# EAGLE design devboard-8.0 (EAGLE 6.3)
Assembly variants: 3cpu, proto
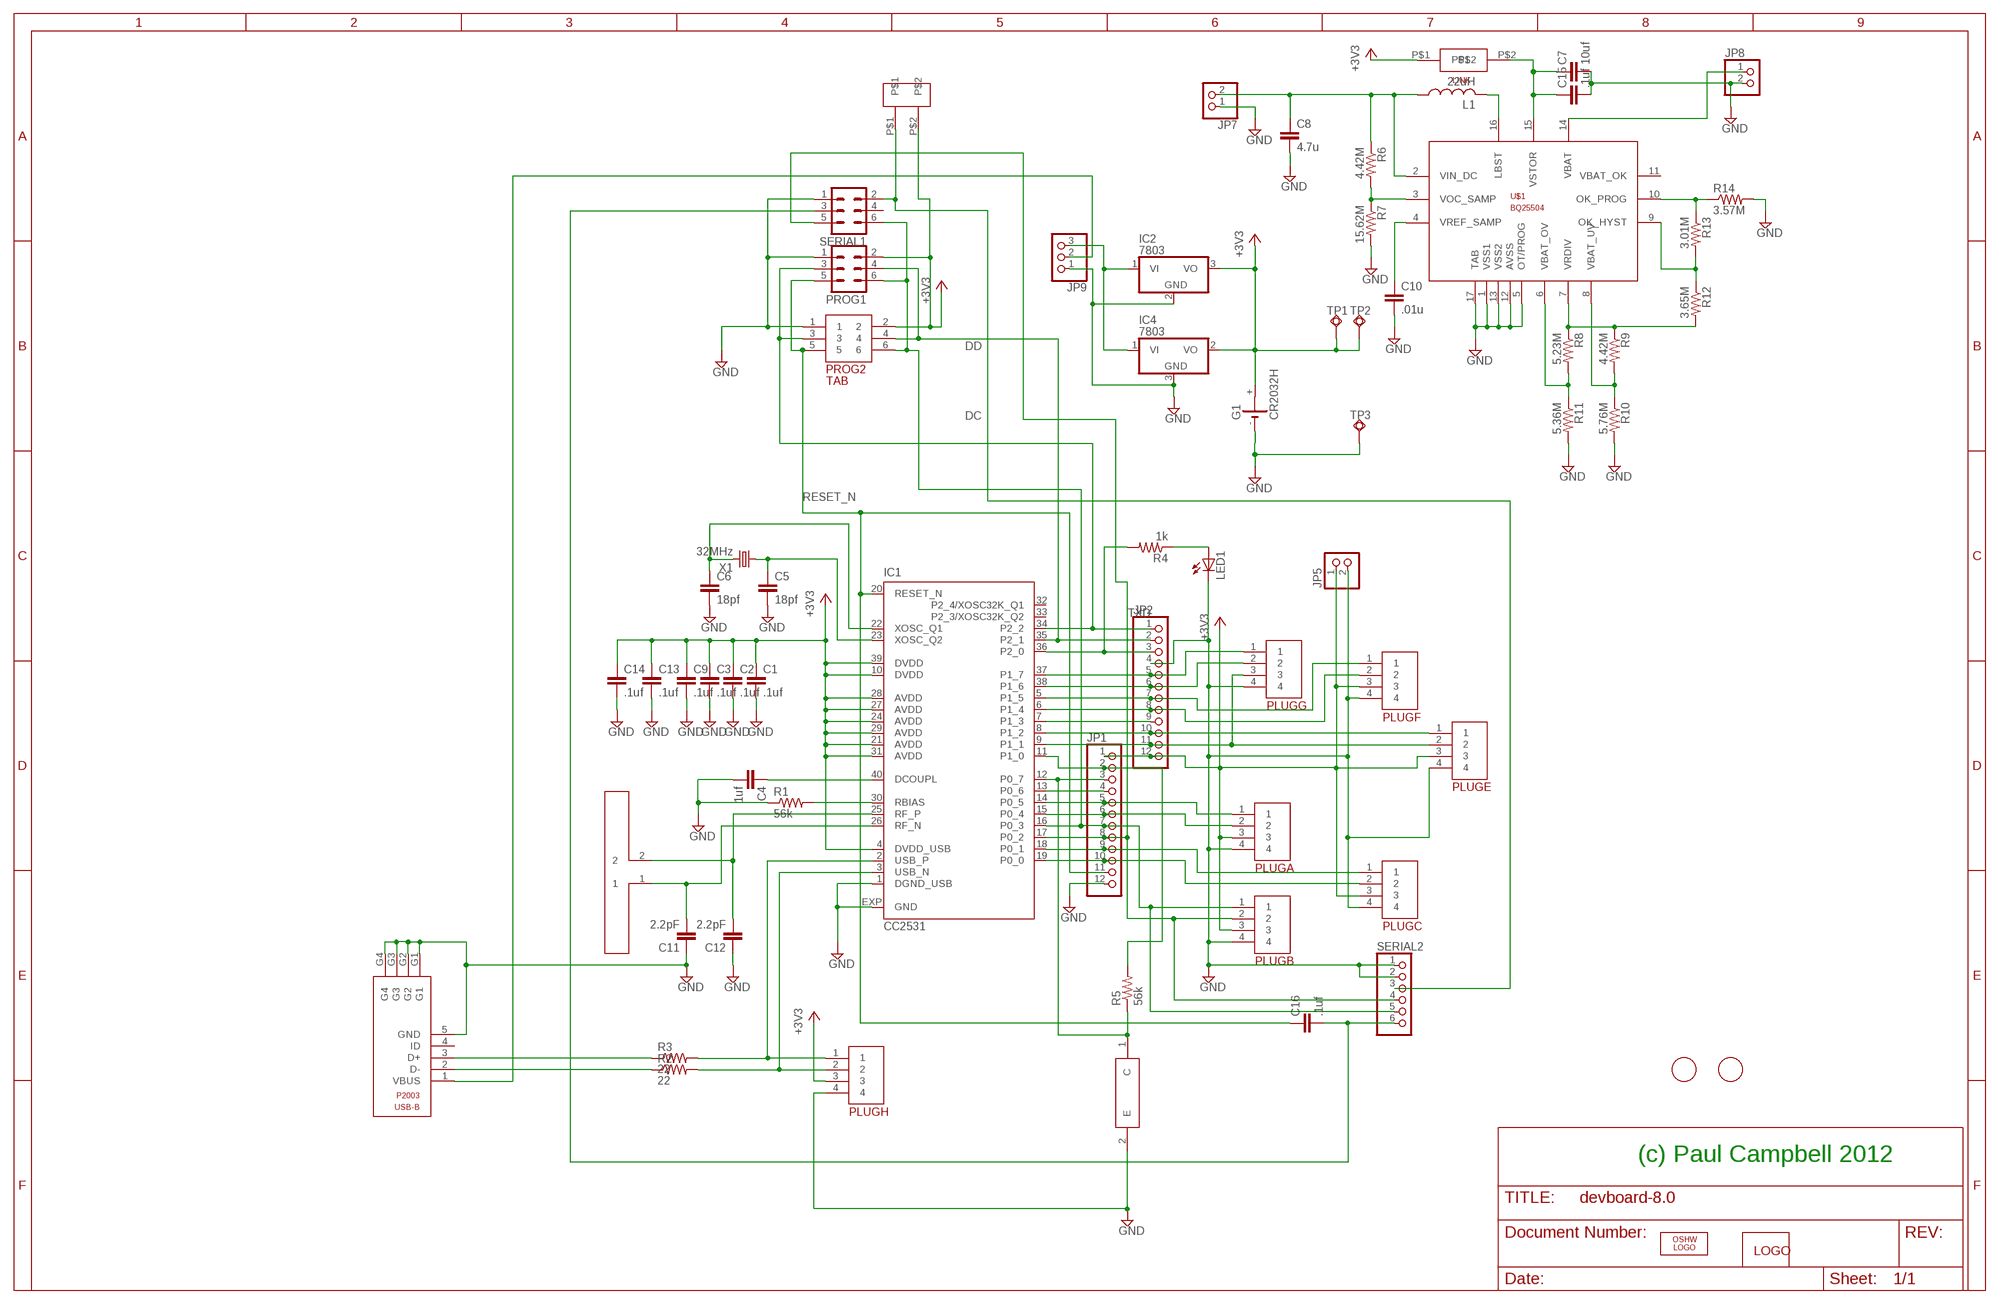
[diagram p0: schematic, sheet 1]

## Parts
C1  .1uf  C-EUC0603K  [C0603K]
C2  .1uf  C-EUC0603K  [C0603K]
C3  .1uf  C-EUC0603K  [C0603K]
C4  1uf  C-EUC0603K  [C0603K]
C5  18pf  C-EUC0603  [C0603]
C6  18pf  C-EUC0603  [C0603]
C7  10uf  C-EUC1206  [C1206]
C8  4.7u  C-EUC0603  [C0603]
C9  .1uf  C-EUC0603K  [C0603K]
C10  .01u  C-EUC0603  [C0603]
C11  2.2pF  C-EUC0402  [C0402]
C12  2.2pF  C-EUC0402  [C0402]
C13  .1uf  C-EUC0603K  [C0603K]
C14  .1uf  C-EUC0603K  [C0603K]
C15  .1uf  C-EUC0603K  [C0603K]
C16  .1uf  C-EUC0603K  [C0603K]
G1  CR2032H  [CR2032H]
IC1  CC2531  [RHA_S-PVQFN-N40]
IC2  7803  7805TV  [TO220V]
IC4  7803  7805DT  [TO252]
JP1  PINHD-1X12-CB  [1X12-CB]
JP2  PINHD-1X12-CB  [1X12-CB]
JP5  PINHD-1X2  [1X02]
JP7  PINHD-1X2  [1X02]
JP8  PINHD-1X2  [1X02]
JP9  PINHD-1X3  [1X03]
L1  22uH  L-USL2012C  [L2012C]
LED1  LEDCHIP-LED0603  [CHIP-LED0603]
LOGO1  OSHW_LOGO_FILLX0100-NT  [OSHW_FILLX100_NOTEXT]
P2003  FCI1018193-USBB  [FCI1018193-USBB]  (not fitted in variant 3cpu)  (not fitted in variant proto)
PLUGA  PIN4  [PIN4-2MM]
PLUGB  PIN4  [PIN4-2MM]
PLUGC  PIN4  [PIN4-2MM]
PLUGE  PIN4  [PIN4-2MM]
PLUGF  PIN4  [PIN4-2MM]
PLUGG  PIN4  [PIN4-2MM]
PLUGH  PIN4  [PIN4-2MM]
PROG1  MA03-2  [MA03-2]
PROG2  TAB  [TAG]
Q1  KDT  [KDT]
R1  56k  R-US_R0603  [R0603]
R2  22  R-US_R0603  [R0603]
R3  22  R-US_R0603  [R0603]
R4  1k  R-US_R0603  [R0603]
R5  56k  R-US_R0603  [R0603]
R6  4.42M  R-US_R0603  [R0603]
R7  15.62M  R-US_R0603  [R0603]
R8  5.23M  R-US_R0603  [R0603]
R9  4.42M  R-US_R0603  [R0603]
R10  5.76M  R-US_R0603  [R0603]
R11  5.36M  R-US_R0603  [R0603]
R12  3.65M  R-US_R0603  [R0603]
R13  3.01M  R-US_R0603  [R0603]
R14  3.57M  R-US_R0603  [R0603]
SERIAL1  MA03-2  [MA03-2]
SERIAL2  PINHD-1X6  [1X06]
SERIAL-POWER  2-PAD  [2-PAD]
TP1  TPSQPAD1-13  [P1-13]
TP2  TPSQPAD1-13  [P1-13]
TP3  TPSQPAD1-13  [P1-13]
U$1  BQ25504  [QF16]
U$2  FIDUCIAL  [FIDUCIAL_1MM]
U$3  DIPOLEDIPOLE1  [DIPOLE]
U$4  2-PAD-LINK  [2-PAD-LINK]
U$5  MOONBASE-LOGO  [MOONBASE-LOGO]
U$18  FIDUCIAL  [FIDUCIAL_1MM]
X1  32MHz  CRYSTALSM49  [SM49]

## Nets
+3V3: C1.1 C2.1 C3.1 C9.1 C13.1 C14.1 G1.+ IC1.4(DVDD_USB) IC1.10(DVDD) IC1.21(AVDD) IC1.24(AVDD) IC1.27(AVDD) IC1.28(AVDD) IC1.29(AVDD) IC1.31(AVDD) IC1.39(DVDD) IC2.3(VO) IC4.2(VO) JP1.1 JP2.12 JP5.1 PLUGA.3 PLUGB.3 PLUGC.3 PLUGE.3 PLUGF.3 PLUGH.3 PROG1.2 PROG2.2 SERIAL-POWER.P$2 TP1.TP TP2.TP U$4.P$1
DC: IC1.34(P2_2) JP2.1 PROG1.3 PROG2.3
DD: IC1.35(P2_1) JP2.2 PROG1.4 PROG2.4
GND: C1.2 C2.2 C3.2 C4.2 C5.2 C6.2 C7.2 C8.2 C9.2 C10.2 C11.1 C12.1 C13.2 C14.2 C15.2 G1.- IC1.1(DGND_USB) IC1.EXP(GND) IC2.2(GND) IC4.3(GND) JP1.12 JP2.4 JP5.2 JP7.1 JP8.2 JP9.1 LED1.C P2003.5(GND) P2003.G1 P2003.G2 P2003.G3 P2003.G4 PLUGA.4 PLUGB.4 PLUGC.4 PLUGE.4 PLUGF.4 PLUGG.4 PLUGH.4 PROG1.1 PROG2.1 Q1.2(E) R1.1 R7.2 R10.2 R11.2 R14.2 SERIAL1.1 SERIAL2.1 SERIAL2.2 TP3.TP U$1.1(VSS1) U$1.5(OT/PROG) U$1.12(AVSS) U$1.13(VSS2) U$1.17(TAB)
N$1: LED1.A R4.1
N$2: JP9.2 P2003.1(VBUS)
N$3: IC1.2(USB_P) PLUGH.1 R3.2
N$4: P2003.2(D-) R2.1
N$5: IC1.3(USB_N) PLUGH.2 R2.2
N$6: SERIAL1.2 SERIAL2.3 SERIAL-POWER.P$1
N$7: P2003.3(D+) R3.1
N$8: IC1.11(P1_0) JP1.2 R5.2
N$9: IC2.1(VI) IC4.1(VI) JP9.3
N$10: C4.1 IC1.40(DCOUPL)
N$11: IC1.13(P0_6) JP1.4
N$12: IC1.14(P0_5) JP1.5 PLUGA.1
N$13: C7.1 C15.1 U$1.15(VSTOR) U$4.P$2
N$14: IC1.18(P0_1) JP1.9 PLUGC.1
N$15: IC1.19(P0_0) JP1.10 PLUGC.2
N$16: IC1.9(P1_1) JP2.11 PLUGE.2 PLUGG.3
N$17: IC1.8(P1_2) JP2.10 PLUGE.1
N$18: C6.1 IC1.22(XOSC_Q1) X1.2
N$19: C5.1 IC1.23(XOSC_Q2) X1.1
N$20: IC1.12(P0_7) JP1.3 Q1.1(C) R5.1
N$21: IC1.7(P1_3) JP2.9
N$22: IC1.30(RBIAS) R1.2
N$23: IC1.6(P1_4) JP2.8 PLUGF.2
N$24: C12.2 IC1.25(RF_P) U$3.2
N$25: C11.2 IC1.26(RF_N) U$3.1
N$26: IC1.5(P1_5) JP2.7 PLUGF.1
N$27: IC1.38(P1_6) JP2.6 PLUGG.2
N$28: IC1.37(P1_7) JP2.5 PLUGG.1
N$29: IC1.36(P2_0) JP2.3 R4.2
N$30: IC1.15(P0_4) JP1.6 PLUGA.2
N$31: C16.2 SERIAL1.3 SERIAL2.6
N$33: L1.2 U$1.16(LBST)
N$34: C8.1 JP7.2 L1.1 R6.1 U$1.2(VIN_DC)
N$35: JP8.1 U$1.14(VBAT)
N$36: R6.2 R7.1 U$1.3(VOC_SAMP)
N$37: C10.1 U$1.4(VREF_SAMP)
N$38: R8.2 R11.1 U$1.6(VBAT_OV)
N$39: R9.2 R10.1 U$1.8(VBAT_UV)
N$40: R13.1 R14.1 U$1.10(OK_PROG)
N$41: R8.1 R9.1 R12.2 U$1.7(VRDIV)
N$42: R12.1 R13.2 U$1.9(OK_HYST)
RESET_N: C16.1 IC1.20(RESET_N) JP1.11 PROG1.5 PROG2.5
RXD: IC1.17(P0_2) JP1.8 PLUGB.2 SERIAL1.5 SERIAL2.4
TXD: IC1.16(P0_3) JP1.7 PLUGB.1 PROG1.6 PROG2.6 SERIAL1.6 SERIAL2.5
Unconnected: G1.+@1(+) IC1.32(P2_4/XOSC32K_Q1) IC1.33(P2_3/XOSC32K_Q2) P2003.4(ID) SERIAL1.4 U$1.11(VBAT_OK)

## Notes on the sheet
- (c) Paul Campbell 2012

## Library data of the parts
C1-C16 = rcl:C-EU: CAPACITOR, European symbol
G1 = battery:CR2032H: LI BATTERY Varta
IC1 = texas:CC2531: A USB Enabled System-On-Chip Solution for 2.4-GHz IEEE 802.15.4 and ZigBee Source: http://focus.ti.com/lit/ds/symlink/cc2531.pdf; MPN: CC2531F256RHAT; OC_FARNELL: 1776351; OC_NEWARK: 34R2713
IC2 IC4 = linear:78*: Positive VOLTAGE REGULATOR Source: http://cache.national.com/ds/LM/LM78L05.pdf http://www.fairchildsemi.com/ds/LM/LM7805.pdf
JP1 JP2 = adafruit:PINHD-1X12: PIN HEADER
JP5 JP7 JP8 = pinhead:PINHD-1X2: PIN HEADER
JP9 = adafruit:PINHD-1X3: PIN HEADER
L1 = rcl:L-US: INDUCTOR, American symbol
LED1 = adafruit:LED: LED OSRAM: - CHIPLED LG R971, LG N971, LY N971, LG Q971, LY Q971, LO R971, LY R971 LH N974, LH R974 LS Q976, LO Q976, LY Q976 LO Q996 - Hyper CHIPLED LW Q18S LB Q993, LB Q99A, LB R99A - SideLED LS A670, LO A670, LY A670, LG A670, LP A670 LB A673, LV A673, LT A673, LW A673 LH A674 LY A675 LS A676, LA A676, LO A676, LY A676, LW A676 LS A679, LY A679, LG A679 - Hyper Micro SIDELED® LS Y876, LA Y876, LO Y876, LY Y876 LT Y87S - SmartLED LW L88C, LW L88S LB L89C, LB L89S, LG L890 LS L89K, LO L89K, LY L89K LS L896, LA L896, LO L896, LY L896 - TOPLED LS T670, LO T670, LY T670, LG T670, LP T670 LSG T670, LSP T670, LSY T670, LOP T670, LYG T670 LG T671, LOG T671, LSG T671 LB T673, LV T673, LT T673, LW T673 LH T674 LS T676, LA T676, LO T676, LY T676, LB T676, LH T676, LSB T676, LW T676 LB T67C, LV T67C, LT T67C, LS T67K, LO T67K, LY T67K, LW E67C LS E67B, LA E67B, LO E67B, LY E67B, LB E67C, LV E67C, LT E67C LW T67C LS T679, LY T679, LG T679 LS T770, LO T770, LY T770, LG T770, LP T770 LB T773, LV T773, LT T773, LW T773 LH T774 LS E675, LA E675, LY E675, LS T675 LS T776, LA T776, LO T776, LY T776, LB T776 LHGB T686 LT T68C, LB T68C - Hyper Mini TOPLED® LB M676 - Mini TOPLED Santana® LG M470 LS M47K, LO M47K, LY M47K Source: http://www.osram.convergy.de/
LOGO1 = ohw-logo:OSHW_LOGO_FILL
P2003 = freescale-imx6:FCI1018193-USBB
PLUGA PLUGB PLUGC PLUGE PLUGF PLUGG PLUGH = playa:PIN4
PROG1 SERIAL1 = con-lstb:MA03-2: PIN HEADER
PROG2 = br:TAB
Q1 = playa:KDT
R1-R14 = rcl:R-US_: RESISTOR, American symbol
SERIAL2 = adafruit:PINHD-1X6: PIN HEADER
SERIAL-POWER = playa:2-PAD
TP1-TP3 = testpad:TPSQ: Test pad
U$1 = playa:BQ25504
U$2 U$18 = adafruit:FIDUCIAL: For use by pick and place machines to calibrate the vision/machine, 1mm By microbuilder.eu
U$3 = playa:DIPOLE
U$4 = playa:2-PAD-LINK
U$5 = ll:MOONBASE-LOGO
X1 = crystal:CRYSTAL: CRYSTAL; OC_FARNELL: unknown; OC_NEWARK: unknown

## Board
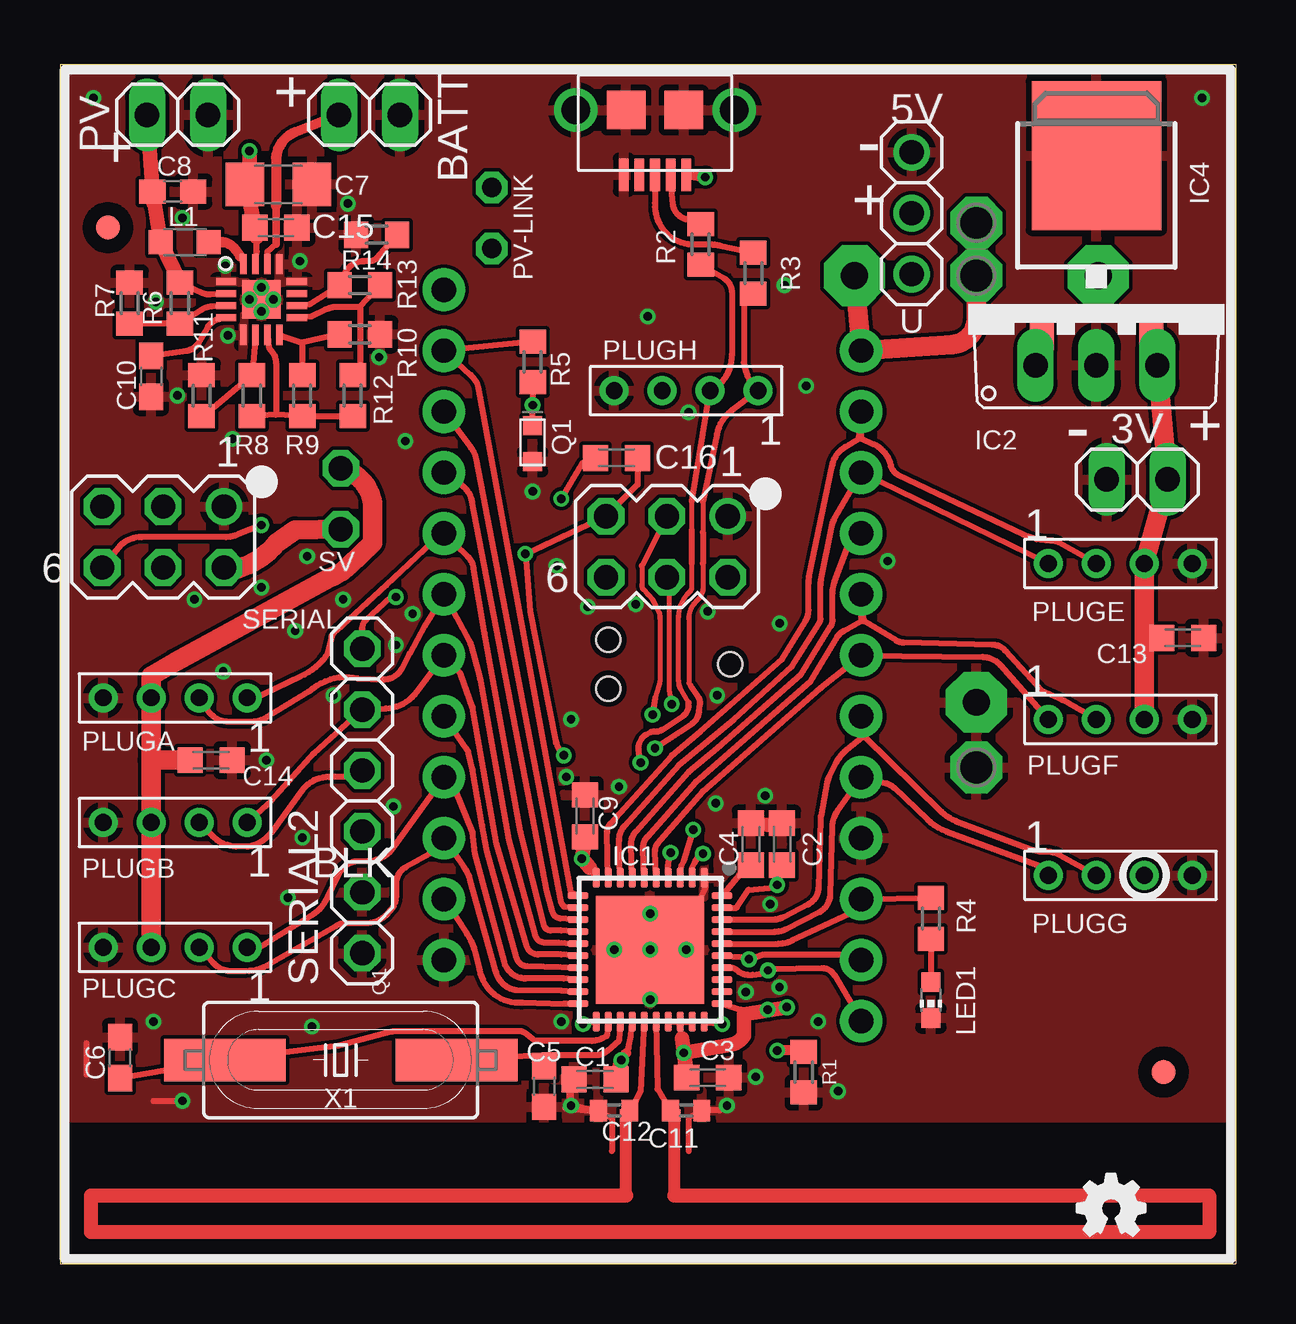
[diagram p1: board, top side]
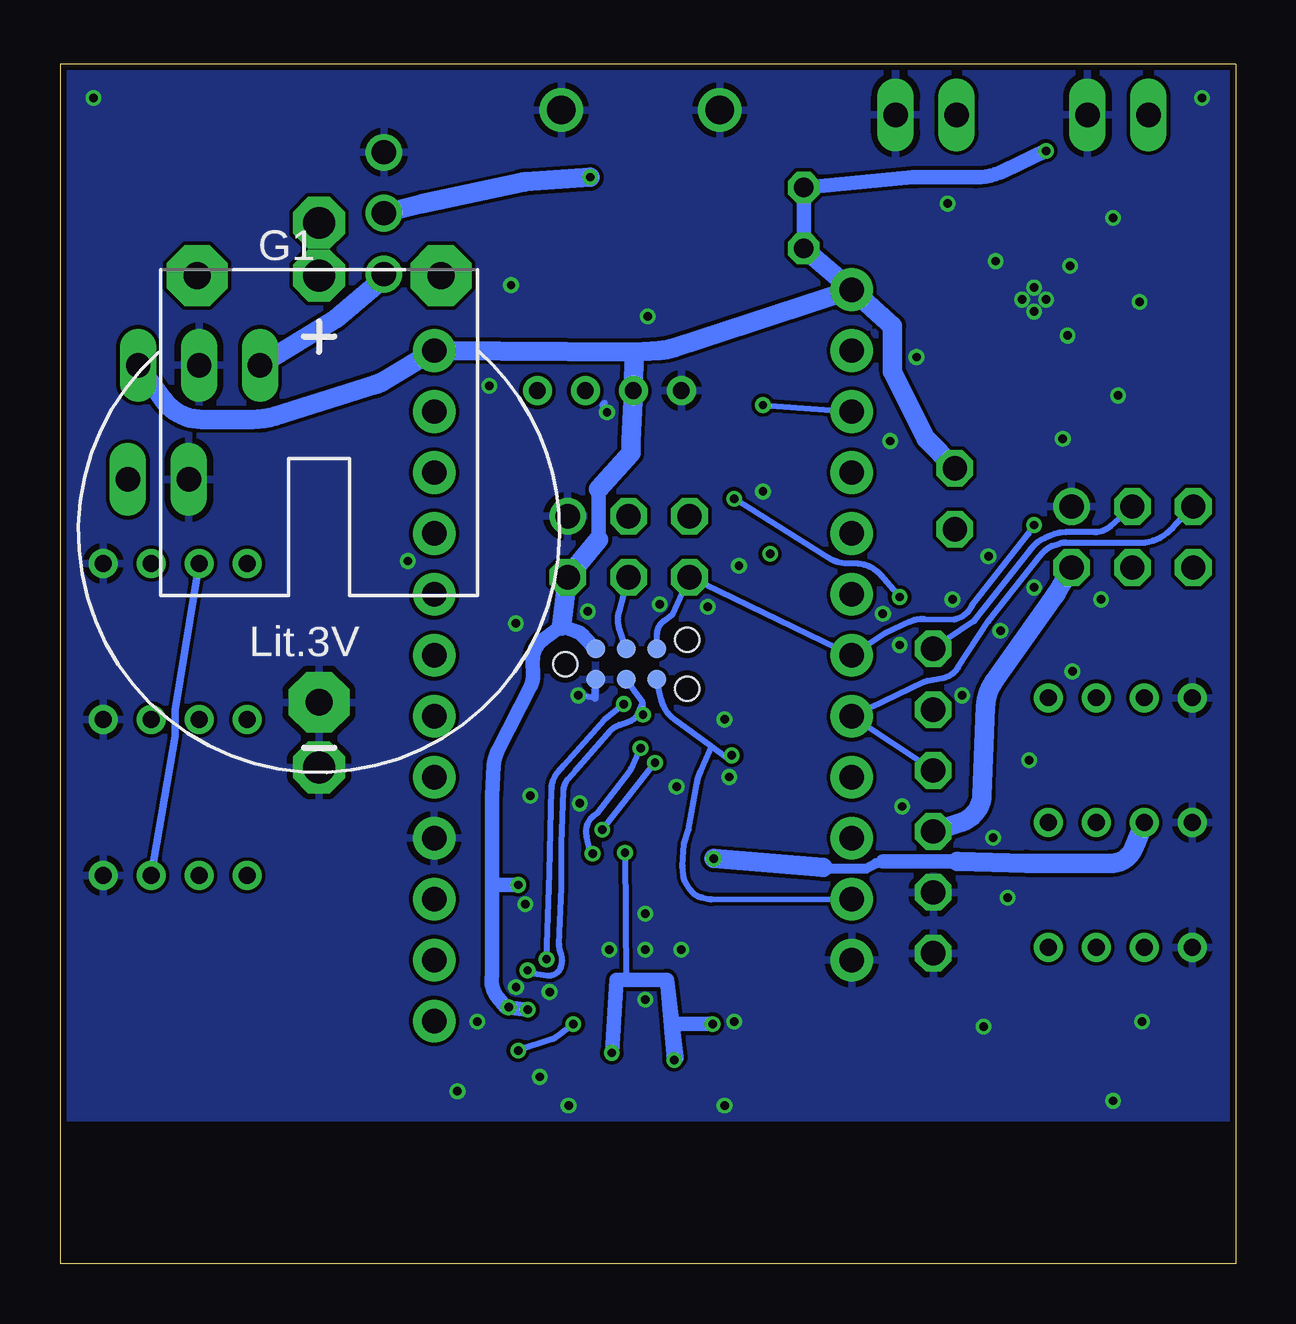
[diagram p2: board, bottom side, seen from below]

Size 49 x 50 mm. Coordinates in mm from the lower left corner, seen from the top.
Outline: 0,0 49,0 49,50 0,50 0,0
Copper layers (1*16): Top 0.035mm / dielectric 1.5mm / Bottom 0.035mm
Design rules "Fusion_eagle_rule_v1.1": minimum track width 6mil, minimum drill 12mil, track to track 6mil, track to pad 6mil, pad to pad 6mil, via to via 6mil, smd to smd 0mil, copper to edge 10mil, drill to drill 10mil, minimum pad ring 10mil, minimum via ring 6mil, stop-mask expansion 2mil, vias tented up to drill 100mil, thermal gap 10mil

### Footprints (pad centres in the part's own frame; a part is rotated, then mirrored left to right if it is on the bottom)
C0603K = smd 1.05 x 1.08: 1 -0.875,0; 2 0.875,0
C0603 = smd 1.1 x 1: 1 -0.85,0; 2 0.85,0
C1206 = smd 1.6 x 1.8: 1 -1.4,0; 2 1.4,0
C0402 = smd 0.7 x 0.9: 1 -0.65,0; 2 0.65,0
CR2032H = drill 1.118 pad 2.54 octagon: + 5.08,10.795; +@1 -5.08,10.795; - 0,-6.985
RHA_S-PVQFN-N40 = smd 0.85 x 0.3: 1 -3,2.25; 2 -3,1.75; 3 -3,1.25; 4 -3,0.75; 5 -3,0.25; 6 -3,-0.25; 7 -3,-0.75; 8 -3,-1.25; 9 -3,-1.75; 10 -3,-2.25; 21 3,-2.25; 22 3,-1.75; 23 3,-1.25; 24 3,-0.75; 25 3,-0.25; 26 3,0.25; 27 3,0.75; 28 3,1.25; 29 3,1.75; 30 3,2.25 | smd 0.3 x 0.85: 11 -2.25,-3; 12 -1.75,-3; 13 -1.25,-3; 14 -0.75,-3; 15 -0.25,-3; 16 0.25,-3; 17 0.75,-3; 18 1.25,-3; 19 1.75,-3; 20 2.25,-3; 31 2.25,3; 32 1.75,3; 33 1.25,3; 34 0.75,3; 35 0.25,3; 36 -0.25,3; 37 -0.75,3; 38 -1.25,3; 39 -1.75,3; 40 -2.25,3 | smd 4.5 x 4.5: EXP 0,0
TO220V = drill 1.016 long: 1 -2.54,-2.54; 2 0,-2.54; 3 2.54,-2.54
TO252 = smd 1 x 1.6: 1 -2.28,-4.8; 2 2.28,-4.8 | smd 5.4 x 6.2: 3 0,2.5
1X12-CB = drill 1.016 pad 1.778: 1 -13.97,0; 2 -11.43,0; 3 -8.89,0; 4 -6.35,0; 5 -3.81,0; 6 -1.27,0; 7 1.27,0; 8 3.81,0; 9 6.35,0; 10 8.89,0; 11 11.43,0; 12 13.97,0
1X02 = drill 1.016 long: 1 -1.27,0; 2 1.27,0
1X03 = drill 1.016: 1 -2.54,0; 2 0,0; 3 2.54,0
L2012C = smd 1 x 1: 1 -1,0; 2 1,0
CHIP-LED0603 = smd 0.8 x 0.8: A 0,-0.75; C 0,0.75
FCI1018193-USBB = smd 0.4 x 1.35: 1 -1.3,2.7; 2 -0.65,2.7; 3 0,2.7; 4 0.65,2.7; 5 1.3,2.7 | drill 1.2: G1 -3.3,0; G4 3.3,0 | smd 1.6 x 1.6: G2 -1.2,0; G3 1.2,0
PIN4-2MM = drill 0.7: 1 -3,0; 2 -1,0; 3 1,0; 4 3,0
MA03-2 = drill 1.016: 1 -2.54,-1.27 | drill 1.016 octagon: 2 -2.54,1.27; 3 0,-1.27; 4 0,1.27; 5 2.54,-1.27; 6 2.54,1.27
TAG = smd 0.787 x 0.787 bottom: 1 -1.27,0.635; 2 -1.27,-0.635; 3 0,0.635; 4 0,-0.635; 5 1.27,0.635; 6 1.27,-0.635 | hole 1: -2.54,0; 2.54,1.016; 2.54,-1.016
KDT = smd 0.8 x 0.8: 1 0.75,0; 2 -0.75,0
R0603 = smd 1 x 1.1: 1 -0.85,0; 2 0.85,0
1X06 = drill 1.016 octagon: 1 -6.35,0; 2 -3.81,0; 3 -1.27,0; 4 1.27,0; 5 3.81,0; 6 6.35,0
2-PAD = drill 1.016 octagon: P$1 -1.27,0; P$2 1.27,0
P1-13 = drill 1.321 pad 2.159 octagon: TP 0,0
QF16 = smd 0.85 x 0.28: 1 -1.475,0.75; 2 -1.475,0.25; 3 -1.475,-0.25; 4 -1.475,-0.75; 9 1.475,-0.75; 10 1.475,-0.25; 11 1.475,0.25; 12 1.475,0.75 | smd 0.28 x 0.85: 5 -0.75,-1.475; 6 -0.25,-1.475; 7 0.25,-1.475; 8 0.75,-1.475; 13 0.75,1.475; 14 0.25,1.475; 15 -0.25,1.475; 16 -0.75,1.475 | smd 1.6 x 1.6: 17 0,0
FIDUCIAL_1MM = smd 1 x 1: 1 0,0
DIPOLE = smd 0.51 x 0.51: 1 -1,0; 2 1,0
2-PAD-LINK = drill 0.8 octagon: P$1 -1.27,0; P$2 1.27,0
SM49 = smd 5.08 x 1.778: 1 -4.826,0; 2 4.826,0

### Placement (x,y rotation side)
C1  22.3,7.7 180 top
C2  30.1,17.5 90 top
C3  27,7.77 0 top
C4  28.8,17.5 90 top
C5  20.18,7.4 270 top
C6  2.5,8.6 90 top
C7  9.1,45 0 top
C8  4.7,44.7 0 top
C9  21.88,18.68 90 top
C10  3.8,37 270 top
C11  26.1,6.4 180 top
C12  23.1,6.4 0 top
C13  46.8,26.1 0 top
C14  6.3,21 0 top
C15  9,43.2 0 top
C16  23.2,33.6 180 top
G1  38.2,30.4 0 bottom
IC1  24.6,13.1 270 top
IC2  43.2,40 0 top
IC4  43.2,43.7 0 top
JP1  16,26.64 270 top
JP2  33.4,24.1 90 top
JP5  44.9,32.7 180 top
JP7  4.9,47.9 180 top
JP8  12.9,47.9 0 top
JP9  35.5,43.8 270 top
L1  5.2,42.6 0 top
LED1  36.3,11 180 top
LOGO1  42.4,1.2 0 top
P2003  24.8,48.1 180 top
PLUGA  4.8,23.6 180 top
PLUGB  4.8,18.4 180 top
PLUGC  4.8,13.2 180 top
PLUGE  44.2,29.2 0 top
PLUGF  44.2,22.7 0 top
PLUGG  44.2,16.2 0 top
PLUGH  26.1,36.4 180 top
PROG1  25.3,29.9 180 top
PROG2  25.4,25 180 top
Q1  19.7,34.2 90 top
R1  31,8 90 top
R2  26.7,42.5 270 top
R3  28.9,41.3 270 top
R4  36.3,14.4 90 top
R5  19.7,37.6 90 top
R6  5,40.05 270 top
R7  2.9,40.05 90 top
R8  8,36.2 90 top
R9  10.1,36.2 90 top
R10  12.5,38.75 0 top
R11  5.9,36.2 90 top
R12  12.2,36.2 270 top
R13  12.5,40.8 0 top
R14  13.2,42.9 180 top
SERIAL1  4.3,30.3 180 top
SERIAL2  12.6,19.3 90 top
SERIAL-POWER  11.7,31.9 90 top
TP1  38.2,43.4 0 top
TP2  38.2,41.2 0 top
TP3  38.2,20.7 0 top
U$1  8.4,40.2 0 top
U$2  46,8 0 top
U$3  24.6,6.2 180 top
U$4  18,43.6 90 top
U$5  0.9,0.6 0 top
U$18  2,43.2 0 top
X1  11.7,8.5 180 top

### Tracks (layer width: path | path; a pad name or v marks a point on that pad's centre or on a via)
+3V3  (via drill 0.35)
  Top 0.254: 25.8,10.1 IC1.28 IC1.29 | 25.8,10.1 IC1.27 | 25.93,9.4 25.9,9.6 25.8,10.1 | 26.1,8.2 C3.1 | 22.1,16.5 IC1.10 | IC1.39 28.2,14.85 28.7,15.6 29.8,15.7 29.9,15.82 C2.1 v29.9,15.8 | 23.6,8.8 23.7,9 23.8,9.5 IC1.24 | IC1.21 v21.8,10 | IC1.31 28.4,10.6 28.7,10.6 v30.3,10.7 | IC4.2 IC2.3 | IC1.4 25.35,16.6 v25.45,17.15
  Top 0.406: 23.6,8.8 v23.4,8.5 | C13.1 45.2,26.2 | TP2.TP TP1.TP
  Top 0.61: v26,8.8 26.1,8.1 26.1,8.2 v26,8.8 | v30.3,10.7 28.5,10.4 28.5,9.5 arc-46 27.95,9.14 v26,8.8 | v26,8.8 25.97,8.82 | 22.1,16.5 v21.75,16.9 C9.1 | C1.1 23.2,7.7 v23.4,8.5 | 25.93,9.4 v26,8.8
  Top 0.813: IC2.3 JP5.1 PLUGE.3 45.2,26.2 PLUGF.3 | 3.8,21 PLUGA.3 3.8,24.5 4.8,25.1 11.25,28.61 arc22 12.05,29.11 13.03,30.05 13.03,31.55 arc62 12.19,32.95 11.81,33.16 11.74,33.18 SERIAL-POWER.P$2 | 3.8,21 PLUGB.3 PLUGC.3 | C14.1 3.8,21 | G1.+ JP2.12 37.2,38.33 arc86 38.2,39.41 TP1.TP
  Bottom 0.254: v25.45,17.15 25.4,11.85
  Bottom 0.406: 23.3,8.6 v23.4,8.5 | 17.2,16.52 16.9,16.48 15.4,16.48 15,16.7 14.7,16.78
  Bottom 0.61: v23.4,8.5 23.7,11.85 | 23.7,11.85 23.5,10 v21.8,10 | 31,15.8 31,19.5 30.92,20.77 arc23 30.75,21.39 29.37,24.12 arc-28 29.29,24.5 29.29,25.18 arc54 28.89,26.01 28.1,26.6 27.47,26.36 arc26 27.17,26.16 PROG2.2 | v30.3,10.7 v29.5,10.6 30.4,10.7 30.76,11.11 arc47 31,12.02 31,13.77 arc-11 31,14.14 31,15.8 | v26,8.8 25.8,11.85 25.4,11.85 23.7,11.85 | 23.7,11.85 23.3,8.6 | 26.55,30.2 26.55,32.3 | v29.9,15.8 31,15.8 | 14.7,16.78 11.6,16.78
  Bottom 0.813: JP1.1 23.39,38.2 arc14 24.03,38.08 25.07,38.01 | 25.07,38.01 JP2.12 35.56,36.78 arc13 35.86,36.65 40.03,35.35 arc17 40.99,35.2 43.08,35.2 arc54 44.7,36.03 IC2.3 | 25.07,38.01 PLUGH.3 25.2,34.3 25.2,33.8 26.55,32.3 | 26.55,30.2 PROG1.2 28.1,26.6 | v21.75,16.9 17.2,16.52 | 11.6,16.78 8.7,16.7 5.2,16.7 arc-68 4.23,17.35 PLUGB.3 | JP1.1 14.3,39.1 14.3,37.2 12.9,34.4 SERIAL-POWER.P$2 | JP1.1 U$4.P$1
DC  (via drill 0.35)
  Top 0.2: 24.26,29.1 24.26,28.32 arc40 24.3,28.13 24.5,27.9 24.7,27.7 24.82,27.42 arc-40 25.01,26.91 25,24.28 arc-17 24.98,24.13 24.81,23.6
  Top 0.254: IC1.34 27.95,12.35 arc-41 28.21,12.25 arc49 28.88,12.05 29.2,12.1 v29.51,12.24 29.6,12.3 31.75,12.33 arc-60 32.28,12.04 JP2.1 | PROG1.3 24.26,29.1 | 24.81,23.6 v24.7,22.9
  Bottom 0.254: v29.51,12.24 29.27,12.13 arc-16 29.12,12.09 28.69,12.03 arc-42 28.34,12.11 28.26,12.16 arc-30 28.17,12.27 arc-45 28.12,12.95 28.16,13.08 arc21 28.2,13.33 28.1,15.7 28.1,17.5 28.01,19.73 arc38 27.82,20.21 27.5,20.6 26.05,22.23 arc30 25.68,22.47 25.29,22.61 arc-48 24.88,22.98 24.7,23.4 | v24.7,22.9 24.7,23.4 | 24.7,23.4 PROG2.3
DD  (via drill 0.35)
  Top 0.2: v25.5,23.34 25.4,23.9 25.4,28.1
  Top 0.254: IC1.35 28.4,12.8 v28.72,12.7 29.3,12.9 32.7,12.9 32.63,12.8 JP2.2 | 25.4,28.1 PROG1.4
  Bottom 0.254: v28.72,12.7 28.6,16.3 28.51,19.82 arc38 28.25,20.49 28,20.8 26.3,22.71 v25.5,23.34 | PROG2.4 25.66,26.39 arc34 25.69,27.21 PROG1.4
GND  (via drill 0.35)
  Top 0.254: 23,4.7 23,6.1 22.1,6.4 | 1.1,9.2 1.1,7.9 | 3.9,6.8 v5.1,6.8 | v27.8,6.6 27.5,6.4 26.8,6.4 26.2,6.1 26.2,4.7 | 26.9,16.3 IC1.1 26.9,16 26.9,15.7 26.6,15
  Top 0.305: C1.2 21.2,7.7 v21.3,6.6 | v21.3,6.6 22.1,6.4 21.1,6.5 v21.3,6.6
  Top 0.61: C4.2 29.5,18.3 C2.2
  Bottom 0.254: 26.7,23.6 v27.4,23.7 | 26.3,35.9 26.4,35.8 26.3,35.7
  Bottom 0.305: PROG2.1 26.7,23.6
  other vias: 24.6,14.6 24.6,11.02 26.1,13.1 23.1,13.1 31.6,10.1 29,7.8 20.9,10.1 10.5,9.9 28.59,11.34 32.43,7.2 21.3,22.7 29.4,19.52 27.33,19.2 14.7,27.1 13.9,19.07 24.6,13.1 23.3,19.9 29.6,15 21.1,20.3 22,27.4 3.9,10.1 29.99,11.54 8.4,40.7 8.9,40.2 8.4,39.7 7.9,40.2 7,38.7 10,41.8 30,26.7 20.7,29.1 19.7,32.2 9.8,26.4 5.6,27.7 6.8,24.7 13.3,37.8 4.9,36.2 4,40.1 6.9,41.6 7.2,34.4 8.6,21 9.5,15.27 12,44.2 5.1,43.6 1.4,48.6 34.5,29.3 31.1,36.6 30.2,40.8 27,27.2 26.2,35.5 24.5,39.5 10.1,17.77 24,27.5 11.4,23.7 10.3,29.5 8.4,28.2 47.6,48.6 14,25.8 11.8,27.7 14.4,34.3
  pour Top: 0.1,50 49,50 49,6.1 0.1,6.1
  pour Bottom: 0,6.1 49,6.1 49,50 0,50
  pour Top: 48.23,23.7 48.23,19.1 48.4,19.1 48.4,24.2 47.9,24.3 47.7,24.2
N$1
  Top 0.254: R4.1 LED1.A
N$2  (via drill 0.35)
  Top 0.406: v26.9,45.3 P2003.1
  Bottom 0.813: v26.9,45.3 29.6,45.11 arc-8 29.8,45.08 33.9,44.2 JP9.2
N$3  (via drill 0.35)
  Top 0.2: 26.8,31.8 26.8,30.5 | 26.8,29.2 26.8,28.1 26.7,27.8 26.5,27.59 arc44 26.21,26.89 26.21,24.2 26.3,24.1
  Top 0.254: R3.2 28.59,40.3 28.5,40.1 28.5,37.58 arc23 28.83,36.67 PLUGH.1 | 29.14,36.54 PLUGH.1 | PLUGH.1 27.99,35.57 arc41 27.38,34.6 26.8,31.8 | 26.8,30.5 26.8,29.2 | v26.8,17.1 26.68,17.01 arc29 26.45,16.73 26.35,16.5 IC1.2 | v24.8,21.5 26.36,22.54 arc49 26.64,22.99 26.68,23.34 arc42 26.61,23.63 26.3,24.1
  Bottom 0.254: v26.8,17.1 26.9,17.2 27.05,17.85 arc34 27,18.34 27,18.34 arc35 26.67,18.76 26.6,18.8 25.31,20.46 arc-14 25.13,20.76 v24.8,21.5
N$4
  Top 0.254: R2.1 26.08,43.55 arc-66 25.54,44.2 25.5,44.6 P2003.2
N$5  (via drill 0.35)
  Top 0.2: 26.2,23.4 25.9,23.91 arc-30 25.79,24.32 25.79,26.98 arc-48 26.25,28.02 arc48 26.34,28.22 26.34,29.2 | 26.34,30.6 26.34,31.8
  Top 0.254: R2.2 27.68,41.09 arc-60 28,40.53 28,37.92 arc-56 27.25,36.47 PLUGH.2 26.34,31.8 | 26.34,29.2 26.34,30.6 | IC1.3 25.9,16.6 26.01,16.8 v26.4,18.1 | v24.2,20.9 24.12,21.48 arc-35 24.16,21.71 24.25,21.89 arc-37 24.41,22.05 24.63,22.17 arc-27 24.77,22.2 24.89,22.2 arc34 25.09,22.26 25.98,22.85 arc56 26.2,23.27 26.2,23.4
  Bottom 0.254: v26.4,18.1 v24.2,20.9
N$6
  Top 0.813: SERIAL1.2 6.69,29.01 arc22 7.39,28.97 7.67,29.07 arc30 9.04,30.06 9.8,30.6 SERIAL-POWER.P$1
  Bottom 0.813: SERIAL2.3 11.39,18.44 arc-69 10.57,19.53 10.42,23.22 arc32 10.08,24.28 7.53,27.85 arc-5 7.47,27.95 SERIAL1.2
N$7
  Top 0.254: R3.1 27.5,42.46 arc12 27.09,42.5 26.32,42.5 arc-90 24.8,44.22 P2003.3
N$8
  Top 0.254: IC1.11 21.3,15.5 17.47,36.43 arc37 17.12,37.05 JP1.2 R5.2
N$9
  Top 0.254: IC4.1 IC2.1
  Bottom 0.406: 35.6,41 JP9.3
  Bottom 0.813: 35.6,41 37.5,39.4 IC2.1
N$10
  Top 0.254: C4.1 28.3,16.2 IC1.40
N$11
  Top 0.254: IC1.13 20.86,14.4 arc-71 20.52,14.68 20.3,15.5 17.18,31.78 arc43 16.75,32.45 JP1.4
N$12
  Top 0.254: 7.8,23.7 PLUGA.1 7.71,23.58 arc-27 7.97,23.51 10.01,24.48 arc38 11.16,25.47 11.31,26.16 arc-17 11.52,26.41 13.6,28.3 15.5,30.1 JP1.5 16.98,29.51 arc-37 17.25,29.01 17.7,26.3 19.2,18 20.17,14.13 arc76 20.46,13.9 20.9,13.9 IC1.14
N$13  (via drill 0.35)
  Top 0.254: U$1.15 8.2,42.2 8.2,42.7 8.2,42.8
  Top 0.406: C15.1 8.2,42.7
  Top 0.61: 8.2,42.8 7.9,44.3 | 7.9,44.3 C7.1 | 7.9,44.3 v7.9,46.4
  Bottom 0.61: v7.9,46.4 9.64,45.57 arc26 10.82,45.3 13.34,45.3 arc-5 13.46,45.29 U$4.P$2
N$14
  Top 0.254: PLUGC.1 arc48 8.54,13.33 10.57,14.6 arc32 11.07,15.14 11.64,16.29 arc-63 12.47,16.8 12.83,16.8 arc54 13.89,17.34 JP1.9 16.5,19.7 17.2,18 17.3,17.1 18.52,12.58 arc75 19.41,11.9 21,11.9 IC1.18
N$15
  Top 0.254: PLUGC.2 6.36,12.58 arc48 7.21,12.2 7.73,12.2 arc35 8.77,12.53 11.49,14.08 arc-30 11.94,14.2 12.76,14.2 arc49 13.66,14.61 13.79,14.76 arc41 14,15.32 14,15.85 arc-60 14.39,16.52 15.4,17.1 JP1.10 16.84,16.53 arc-19 17.08,16.03 18.14,12.24 arc71 19.04,11.42 20.9,11.4 IC1.19
N$16
  Top 0.254: PLUGE.2 41.63,30.08 arc29 41.35,30.15 41.28,30.15 arc-25 40.17,30.4 34.96,32.88 arc-52 34.64,33.28 34.64,33.29 arc53 33.93,34.16 33.4,34.4 JP2.11 33.3,34.4 32.73,34.05 arc47 32.2,33.31 31.23,28.63 arc12 31.2,28.37 31.2,27.25 arc-31 31.07,26.79 30.1,25.2 26.7,22.2 25.5,21.2 22.95,18.37 arc43 22.8,17.98 IC1.9
  Bottom 0.305: PLUGE.2 44.2,23.1 44.2,22 PLUGG.3
N$17
  Top 0.254: PLUGE.1 JP2.10 32.27,31.02 arc19 32.17,30.76 31.72,28.5 arc11 31.7,28.3 31.7,26.89 arc-32 31.65,26.72 30.5,24.9 28.1,22.7 25.8,20.8 23.54,18.27 arc43 23.31,17.64 IC1.8
N$18
  Top 0.254: IC1.22 22.8,9.5 22.61,9.41 arc-27 22.16,9.3 19.8,9.3 19.38,9.63 arc39 19.2,9.7 13.94,9.7 arc15 13.86,9.69 11.6,9.1 X1.2 C6.1
N$19
  Top 0.254: IC1.23 23.3,9.3 22.8,8.87 arc-41 22.34,8.7 20.1,8.7 | C5.1 20.1,8.7 | 20.1,8.7 X1.1
N$20  (via drill 0.35)
  Top 0.254: 21.5,14.85 IC1.12 21,14.9 arc-34 20.87,15.14 17.35,33.52 arc26 17.13,34.02 JP1.3 | R5.1 v19.7,35.8 Q1.1
  Bottom 0.254: v19.7,35.8 JP1.3
N$21
  Top 0.254: IC1.7 23.81,17.48 arc-43 24.01,18.04 26.2,20.5 27.4,21.5 30.9,24.6 32.12,26.58 arc32 32.2,26.84 32.2,27.96 arc-21 32.28,28.42 32.8,29.8 JP2.9
N$22  (via drill 0.35)
  Top 0.254: IC1.30 v27.6,10 | 31,8.9 31.1,8.8 R1.2
  Top 0.406: 31,8.9 v29.9,8.9
  Bottom 0.254: v27.6,10 28.31,9.47 arc18 28.51,9.36 v29.9,8.9
N$23
  Top 0.254: PLUGF.2 41.8,23.5 40.9,23.9 39.43,25.54 arc47 38.85,25.81 35.17,25.9 arc-30 34.86,25.99 33.5,26.8 JP2.8 33.4,26.8 32.67,26.39 arc30 32.4,26.13 31.3,24.3 26.5,20.1 24.48,17.81 arc43 24.31,17.32 IC1.6
N$24
  Top 0.254: IC1.25 24.2,7.2 24,6.8 U$3.2 C12.2
N$25
  Top 0.254: IC1.26 24.9,7.3 25.2,6.8 U$3.1 C11.2
N$26
  Top 0.254: PLUGF.1 39.2,24.97 arc48 38.45,25.31 JP2.7 31.7,24 26.8,19.7 24.91,17.52 arc43 24.81,17.24 IC1.5
N$27
  Top 0.254: IC1.38 29.73,14.35 arc27 30.15,14.45 31.18,14.98 arc61 31.61,15.68 31.7,18.54 arc-9 31.71,18.66 31.98,20.07 arc-16 32.06,20.32 32.34,20.88 arc-25 32.78,21.43 33.5,22 | JP2.6 33.5,22 | 33.5,22 36.75,18.85 arc23 37.33,18.48 40.49,17.28 arc21 40.92,17.2 41.1,17.2 arc-29 41.66,17.06 PLUGG.2
N$28
  Top 0.254: IC1.37 29.79,13.85 arc27 30.28,13.97 31.65,14.67 arc61 32.11,15.41 32.19,18.2 arc-34 32.43,18.91 JP2.5 34.39,20.05 arc-30 34.76,19.85 36.16,18.52 arc23 36.94,18.04 40.73,16.62 arc-25 40.85,16.55 PLUGG.1
N$29
  Top 0.254: IC1.36 29.94,13.35 arc25 30.52,13.48 32.9,14.6 JP2.3 R4.2
N$30
  Top 0.254: IC1.15 20.8,13.4 20.21,13.4 arc-74 19.81,13.7 18.7,17.7 17.5,24.4 17.13,25.8 arc14 17.05,25.99 JP1.6 15.2,26.6 14.57,25.43 14.25,24.82 arc-63 13.46,24.36 12.43,24.4 arc55 10.39,23.87 8.57,22.75 arc-29 8,22.6 7.03,22.6 arc-55 6.2,23.04 PLUGA.2
N$31  (via drill 0.35)
  Top 0.254: SERIAL2.6 12.6,26.48 arc-47 12.76,26.85 13.8,27.8 v14,27.8 | v20.9,31.9 21.8,33.4 22.12,33.4 C16.2
  Bottom 0.254: v14,27.8 14.77,28.7 arc-49 15.86,29.2 16.18,29.2 arc32 16.96,29.43 v20.9,31.9 | SERIAL1.3 5.22,30.75 arc42 5.88,30.5 7.08,30.5 arc-24 7.69,30.37 7.96,30.25 arc-28 8.53,29.8 10.9,26.8 SERIAL2.6
N$33
  Top 0.254: 7.5,42 U$1.16
  Top 0.406: L1.2 6.71,42.6 arc-56 7.31,42.28 7.5,42
N$34
  Top 0.254: C8.1 3.9,44.2 | U$1.2 6.27,40.41 arc-28 5.94,40.47 R6.1
  Top 0.61: 3.9,44.2 3.86,44.67 | 3.86,44.67 L1.1 R6.1 | JP7.2 3.86,44.67
N$35
  Top 0.254: U$1.14 8.65,42.2 9,42.5
  Top 0.305: 9,44.1 9,42.5
  Top 0.406: JP8.1 9.82,47.18 arc61 9,46.13 9,46.1 9,44.1
N$36
  Top 0.254: U$1.3 6.34,39.91 arc29 5.89,39.77 R6.2 R7.1
N$37
  Top 0.254: U$1.4 6.62,39.38 arc46 6.14,39.02 5.76,38.38 arc-52 5.28,38.05 C10.1
N$38
  Top 0.254: U$1.6 R8.2 6.4,35.7 R11.1
N$39
  Top 0.254: U$1.8 10.1,38.4 | R10.1 10.1,38.4 | 10.1,38.4 R9.2
N$40
  Top 0.254: U$1.10 10.4,40 R13.1 11.86,41.27 arc-66 12.69,41.8 12.91,41.8 arc49 13.22,41.94 R14.1
N$41
  Top 0.254: U$1.7 8.7,38.2 8.85,37.99 arc-37 9,37.56 9,35.4 | 9,35.4 R8.1 | 9,35.4 R9.1 R12.2
N$42
  Top 0.254: R13.2 12.5,39.9 | 12.5,39.9 12.5,37.2 R12.1 | U$1.9 10.5,39.5 11.07,39.79 arc-27 11.55,39.9 12.5,39.9
RESET_N  (via drill 0.35)
  Top 0.254: IC1.20 21,10.85 19.3,10.9 19.23,10.89 arc13 18.97,10.9 arc-74 17.48,12.27 17.3,12.99 arc20 16.96,13.76 JP1.11 | v21,21.2 20.84,21.41 arc-26 20.66,21.81 19.6,27.2 v19.4,29.6 PROG1.5 24.07,32.48 C16.1
  Bottom 0.254: JP1.11 21.83,15.2 arc13 21.97,15.22 22.26,15.28 arc43 22.73,15.61 22.89,15.84 arc29 23.02,16.19 23.05,16.6 23,17.5 22.8,18.1 22.44,20.06 arc14 22.3,20.52 21.83,21.56 | 21.83,21.56 21.2,21.1 21.25,21.14 v21,21.2 | 21.83,21.56 23.39,22.7 arc40 23.92,23.5 PROG2.5
RXD
  Top 0.254: IC1.17 19.47,12.41 arc-73 19.04,12.75 17.8,17.2 17.6,18.3 17.2,20.6 17.02,21.31 arc21 16.95,21.48 JP1.8 | PLUGB.2 6.36,17.84 arc45 7.33,17.4 7.79,17.4 arc27 8.19,17.5 8.27,17.54 arc27 8.81,17.99 10.07,19.71 arc-54 11.23,20.3 12.2,20.3 SERIAL2.4
  Bottom 0.254: SERIAL2.4 JP1.8 15.9,22.8 15.8,22.9 13,24.25 arc15 12.79,24.32 12.22,24.42 arc-47 11.57,24.86 10.3,26.8 8.18,29.48 8.14,29.53 arc28 7.66,29.93 7.32,30.04 arc18 7.07,30.08 3.76,30.08 arc-45 2.5,30.83 SERIAL1.5
TXD  (via drill 0.35)
  Top 0.254: IC1.16 20.9,12.9 19.94,12.9 arc-74 19.44,13.28 18.2,17.5 17.2,23.2 16.71,24.56 arc23 16.67,24.63 JP1.7 14.88,23.85 arc-51 13.59,23.16 SERIAL2.5 10.6,21.3 8.8,19.3 PLUGB.1 | v8.4,30.8 7.45,30.43 arc-27 6.92,30.3 3.39,30.3 arc51 2.42,29.84 SERIAL1.6
  Bottom 0.254: PROG2.6 24.11,26.26 arc51 23.83,26.8 23.46,27.08 PROG1.6 JP1.7 14.6,26.3 13.57,26.78 arc26 13.01,26.89 11.74,26.87 arc-55 10.95,27.5 8.63,30.44 8.43,30.79 v8.4,30.8

### Text on the board
tPlace: PV | 5V | + | + | - | BATT | + | U | PLUGH | Q1 | - | 3V | + | SV | SERIAL | PLUGE | PLUGA | PLUGF | PLUGB | BLK | PLUGG | PLUGC
tNames: PV-LINK | Q1
tDocu: V8.0 | (C) Paul Campbell 2012